# Altium schematic sheet [02] MCU.SchDoc: MCU
size A4
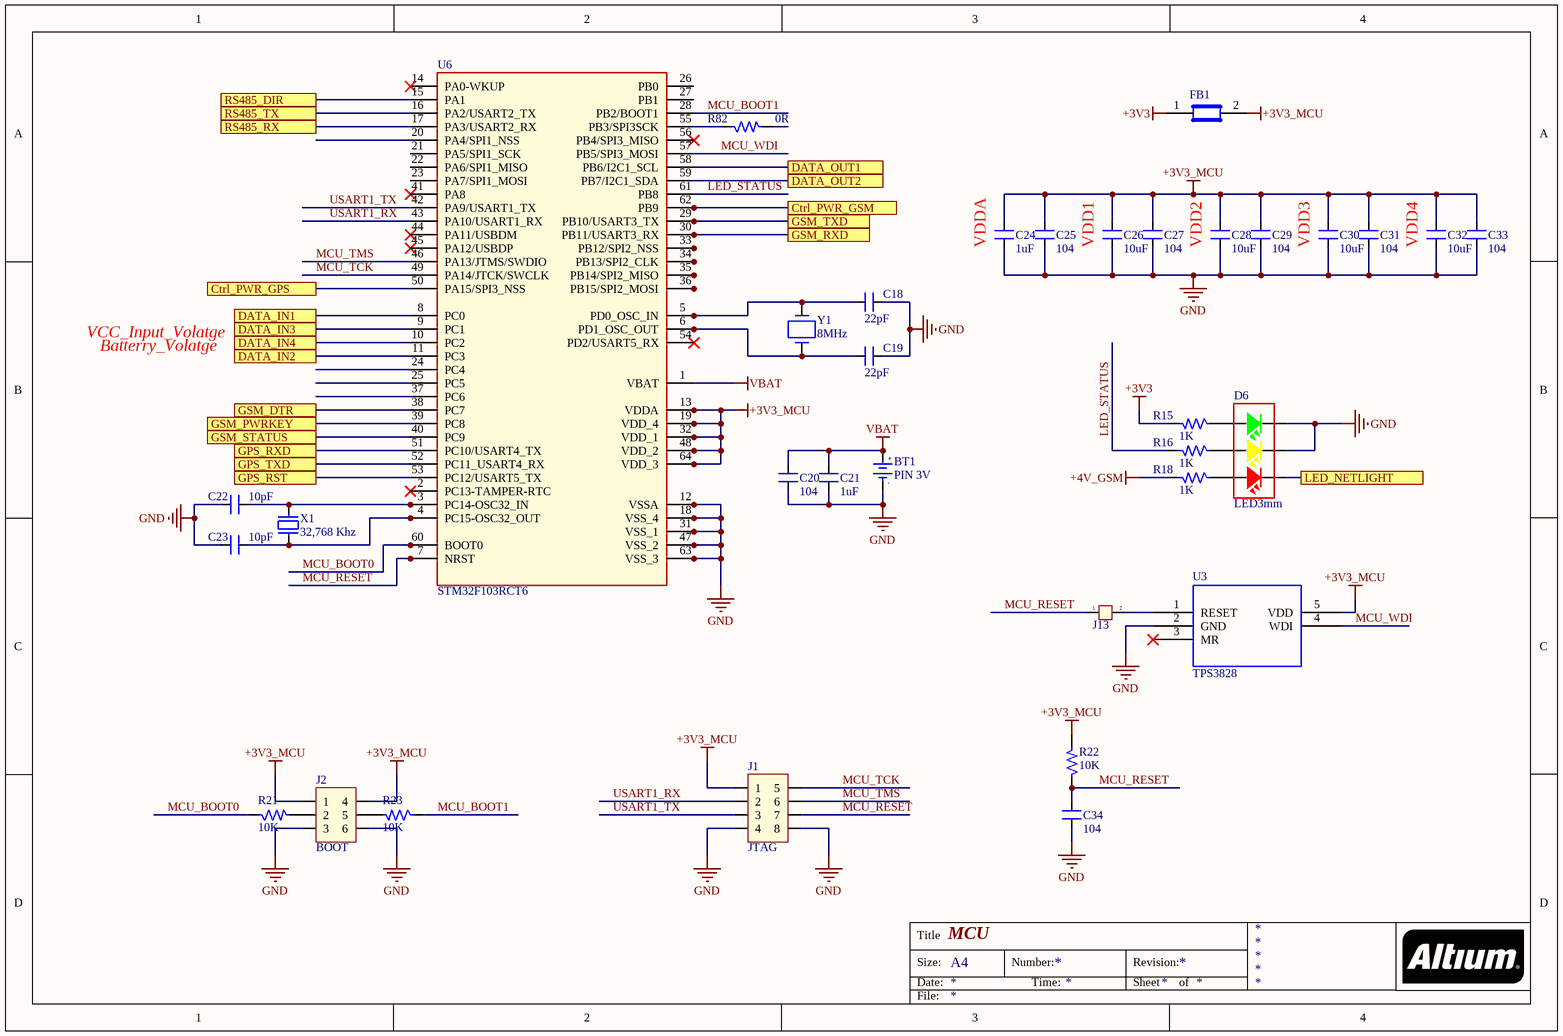
[diagram p0: [02] MCU.SchDoc]

## Parts
BT1  PIN 3V  [PIN3V_mini]
C18  22pF  [C0603 SMT]
C19  22pF  [C0603 SMT]
C20  104  [C0603 SMT]
C21  1uF  [C0603 SMT]
C22  10pF  [C0603 SMT]
C23  10pF  [C0603 SMT]
C24  1uF  [C0603 SMT]
C25  104  [C0603 SMT]
C26  10uF  [C0603 SMT]
C27  104  [C0603 SMT]
C28  10uF  [C0603 SMT]
C29  104  [C0603 SMT]
C30  10uF  [C0603 SMT]
C31  104  [C0603 SMT]
C32  10uF  [C0603 SMT]
C33  104  [C0603 SMT]
C34  104  [C0603 SMT]
D6  LED3mm  [LED 3 holder 3mm]
FB1  BLM21PG600SN1D  [R0805]  (value not drawn)
J1  JTAG  [JP4x2]
J2  BOOT  [JP3x2]
J13  watdog  [JP2]  (value not drawn)
R15  1K  [R0603 -SMT]
R16  1K  [R0603 -SMT]
R18  1K  [R0603 -SMT]
R21  10K  [R0603 -SMT]
R22  10K  [R0603 -SMT]
R23  10K  [R0603 -SMT]
R82  0R  [R0603 -SMT]
U3  TPS3828  [TPS3828]
U6  STM32F103RCT6  [LQFP-64]
X1  32,768 Khz  [XT32kn]
Y1  8MHz  [ABM7_v1_1_BIG]

## Ports
Ctrl_PWR_GPS, Ctrl_PWR_GSM, DATA_IN1, DATA_IN2, DATA_IN3, DATA_IN4, DATA_OUT1, DATA_OUT2, GPS_RST, GPS_RXD, GPS_TXD, GSM_DTR, GSM_PWRKEY, GSM_RXD, GSM_STATUS, GSM_TXD, LED_NETLIGHT, RS485_DIR, RS485_RX, RS485_TX

## Nets
+3V3: FB1.1 R15.2
+3V3_MCU: C24.2 C25.2 C26.2 C27.2 C28.2 C29.2 C30.2 C31.2 C32.2 C33.2 FB1.2 J1.1 J2.1 J2.4 R22.2 U3.5(VDD) U6.13(VDDA) U6.19(VDD_4) U6.32(VDD_1) U6.48(VDD_2) U6.64(VDD_3)
+4V_GSM: R18.2
GND: BT1.2(GND) C18.2 C19.2 C20.1 C21.1 C22.2 C23.2 C24.1 C25.1 C26.1 C27.1 C28.1 C29.1 C30.1 C31.1 C32.1 C33.1 C34.2 D6.3 D6.5 J1.4 J1.8 J2.3 J2.6 U3.2(GND) U6.12(VSSA) U6.18(VSS_4) U6.31(VSS_1) U6.47(VSS_2) U6.63(VSS_3)
VBAT: BT1.1(+3V) C20.2 C21.2 U6.1(VBAT)
Ctrl_PWR_GPS: U6.50(PA15/SPI3_NSS) ; port Ctrl_PWR_GPS
Ctrl_PWR_GSM: U6.62(PB9) ; port Ctrl_PWR_GSM
DATA_IN1: U6.8(PC0) ; port DATA_IN1
DATA_IN2: U6.11(PC3) ; port DATA_IN2
DATA_IN3: U6.9(PC1) ; port DATA_IN3
DATA_IN4: U6.10(PC2) ; port DATA_IN4
DATA_OUT1: U6.58(PB6/I2C1_SCL) ; port DATA_OUT1
DATA_OUT2: U6.59(PB7/I2C1_SDA) ; port DATA_OUT2
GPS_RST: U6.53(PC12/USART5_TX) ; port GPS_RST
GPS_RXD: U6.51(PC10/USART4_TX) ; port GPS_RXD
GPS_TXD: U6.52(PC11_USART4_RX) ; port GPS_TXD
GSM_DTR: U6.38(PC7) ; port GSM_DTR
GSM_PWRKEY: U6.39(PC8) ; port GSM_PWRKEY
GSM_RXD: U6.30(PB11/USART3_RX) ; port GSM_RXD
GSM_STATUS: U6.40(PC9) ; port GSM_STATUS
GSM_TXD: U6.29(PB10/USART3_TX) ; port GSM_TXD
LED_NETLIGHT: D6.1 ; port LED_NETLIGHT
LED_STATUS: R16.2 U6.61(PB8)
MCU_BOOT0: R21.1 U6.60(BOOT0)
MCU_BOOT1: R23.1 U6.28(PB2/BOOT1)
MCU_RESET: C34.1 J1.7 J13.1 R22.1 U6.7(NRST)
MCU_TCK: J1.5 U6.49(PA14/JTCK/SWCLK)
MCU_TMS: J1.6 U6.46(PA13/JTMS/SWDIO)
MCU_WDI: U3.4(WDI) U6.57(PB5/SPI3_MOSI)
RS485_DIR: U6.15(PA1) ; port RS485_DIR
RS485_RX: U6.17(PA3/USART2_RX) ; port RS485_RX
RS485_TX: U6.16(PA2/USART2_TX) ; port RS485_TX
USART1_RX: J1.2 U6.43(PA10/USART1_RX)
USART1_TX: J1.3 U6.42(PA9/USART1_TX)
NetC18_1: C18.1 U6.5(PD0_OSC_IN) Y1.2
NetC19_1: C19.1 U6.6(PD1_OSC_OUT) Y1.1
NetC22_1: C22.1 U6.3(PC14-OSC32_IN) X1.1
NetC23_1: C23.1 U6.4(PC15-OSC32_OUT) X1.2
NetD6_2: D6.2 R18.1
NetD6_4: D6.4 R16.1
NetD6_6: D6.6 R15.1
NetJ2_2: J2.2 R21.2
NetJ2_5: J2.5 R23.2
NetJ13_2: J13.2 U3.1(RESET)
NetR82_1: R82.1 U6.55(PB3/SPI3SCK)

Not connected (* = marked no-connect by the designer): R82 2; U3 3(MR)*; U6 2(PC13-TAMPER-RTC)* 14(PA0-WKUP)* 20(PA4/SPI1_NSS) 21(PA5/SPI1_SCK) 22(PA6/SPI1_MISO) 23(PA7/SPI1_MOSI) 24(PC4) 25(PC5) 26(PB0) 27(PB1) 33(PB12/SPI2_NSS) 34(PB13/SPI2_CLK) 35(PB14/SPI2_MISO) 36(PB15/SPI2_MOSI) 37(PC6) 41(PA8)* 44(PA11/USBDM)* 45(PA12/USBDP)* 54(PD2/USART5_RX)* 56(PB4/SPI3_MISO)*

## Notes on the sheet
- (near C24) VDDA
- (near C26) VDD1
- (near C28) VDD2
- (near C30) VDD3
- (near C32) VDD4
- VCC_Input_Volatge
- Batterry_Volatge
- Title
- Size:
- Date:
- A4
- Number:
- Time:
- Revision:
- Sheet
- of
- File:
- (in symbol PIN 3V) +; -

## Library data of the parts
BT1 = PIN 3V: Battery 3VDC; Value: PIN 3V
C18-C34 = CM: Cap SMD; Value: 103
D6 = LED3Holder_3: LED 3 holder RGB 3mm; Value: LED 3 ly Single Colour
FB1 = Ferrite Bead
J1 = JP4x2: Connector 4x2; Value: Connector 4x2
J2 = JP3x2: Connector 3x2; Value: Connector 3x2
J13 = JP 2: Jumper 2; Value: JP 2
R15 R16 R18 = RM: Resistor SMD; Value: 1K
R21-R23 R82 = RM: Resistor SMD; Value: 1K
U6 = STM32F103RCT6: MCU 32BIT 256KB FLASH 64LQFP
X1 = XT32k: Crystal 32,768kHz for timer real; Value: 32,768khz
Y1 = ABM7-16.000MHZ-D2Y-T: CRYSTAL 16MHZ 18PF SMD; Manufacturer: Abracon LLC; Frequency Stability: ±30ppm; Frequency Tolerance: ±20ppm; ESR (Equivalent Series Resistance): 50 Ohm; Operating Mode: Fundamental; .Creator: MM; .Checked PCB: RF; Supplier 1: Digi-Key; Manufacturer Part Number: ABM7-16.000MHZ-D2Y-T; RoHS: RoHS Compliant; Category: Crystals and Oscillators; Stock 1: 5861; Pricing 1: 1=0.96, 10=0.847, 50=0.791, 100=0.7, 500=0.6615 (USD); Packaging: Cut Tape (CT); Type: MHz Crystal; Frequency: 16MHz; Load Capacitance: 18pF; Operating Temperature: -40°C ~ 85°C; Ratings: -; Mounting Type: Surface Mount; Package / Case: 2-SMD; Size / Dimension: 0.236" L x 0.138" W (6.00mm x 3.50mm); Height: 0.055" (1.40mm); ComponentLink1URL: http://www.abracon.com/Resonators/abm7.pdf; ComponentLink1Description: http://www.abracon.com/Resonators/abm7.pdf; Supplier Part Number 1: 535-9840-1-ND; .Checked SCH: RF